# EAGLE schematic RoversGitaarReverb (EAGLE 7.7.0)
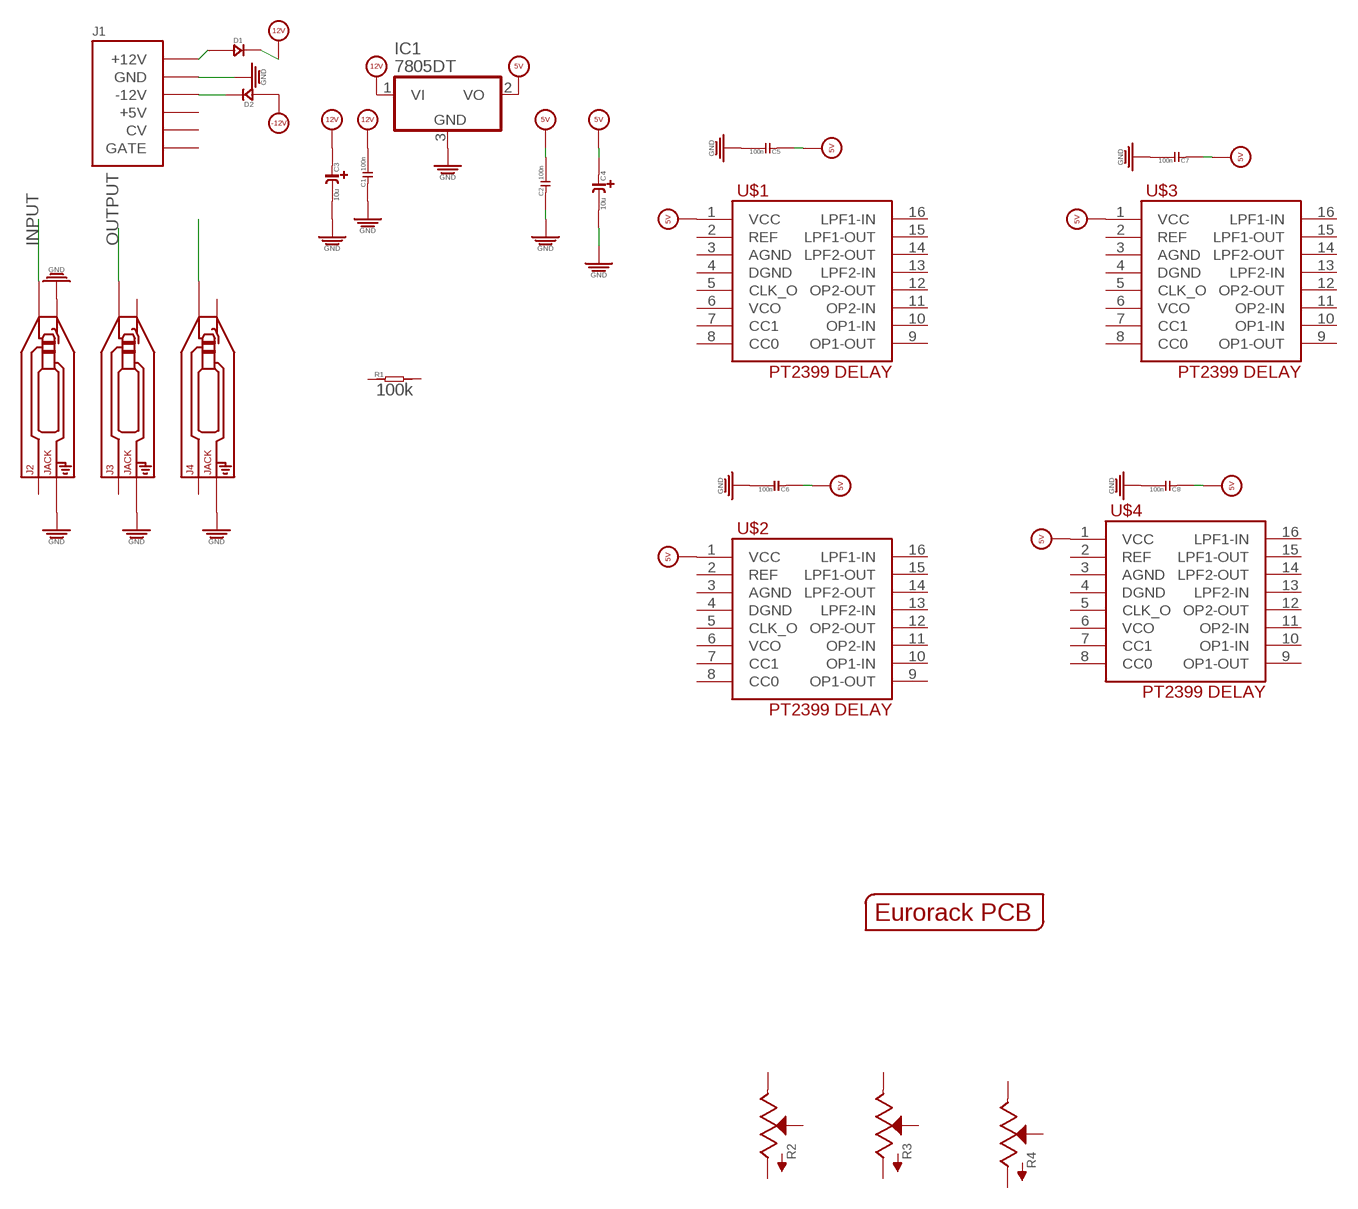
[diagram p0: schematic, sheet 1]

## Parts
C1  100n  C-0603  [C0603]
C2  100n  C-0603  [C0603]
C3  10u  C-POLAR-A  [CASE-A_3216]
C4  10u  C-POLAR-A  [CASE-A_3216]
C5  100n  C-0603  [C0603]
C6  100n  C-0603  [C0603]
C7  100n  C-0603  [C0603]
C8  100n  C-0603  [C0603]
D1  D-SMA  [DO-214AC]
D2  D-SMA  [DO-214AC]
IC1  7805DT  [TO252]
J1  POWERSHROUDED  [POWER_16_SHROUDED]
J2  JACK  AUDIO-JACK_SMALLSYMBOLNODRILL  [3.5MM-JACK-SWITCH-13MM-NOHOLES]
J3  JACK  AUDIO-JACK_SMALLSYMBOLNODRILL  [3.5MM-JACK-SWITCH-13MM-NOHOLES]
J4  JACK  AUDIO-JACK_SMALLSYMBOLNODRILL  [3.5MM-JACK-SWITCH-13MM-NOHOLES]
PCB1  EURORACK_PCB12HP  [EURORACK12HPPCB]
R1  100k  R-0603  [R0603]
R2  POTSQUAREHOLE_SMALLKNOB  [ALPS_POT_SQUAREHOLES]
R3  POTSQUAREHOLE_SMALLKNOB  [ALPS_POT_SQUAREHOLES]
R4  POTSQUAREHOLE_SMALLKNOB  [ALPS_POT_SQUAREHOLES]
U$1  PT2399  [SO16]
U$2  PT2399  [SO16]
U$3  PT2399  [SO16]
U$4  PT2399  [SO16]

## Nets
5V: C2.2 C4.+ C5.1 C6.1 C7.1 C8.1 IC1.2(VO) U$1.1(VCC) U$2.1(VCC) U$3.1(VCC) U$4.1(VCC)
12V: C1.2 C3.+ D1.2(-) IC1.1(VI)
-12V: D2.1(+)
GND: C1.1 C2.1 C3.- C4.- C5.2 C6.2 C7.2 C8.2 IC1.3(GND) J1.3(GND) J1.4(GND) J1.5(GND) J1.6(GND) J1.7(GND) J1.8(GND) J2.RING_B@1(RING) J2.RING_T@3(RING) J2.SWITCH_B@1(SWITCH) J2.SWITCH_T@3(SWITCH) J3.RING_B@1(RING) J3.RING_T@3(RING) J4.RING_B@1(RING) J4.RING_T@3(RING)
INPUT: J2.TIP_B@1(TIP) J2.TIP_T@3(TIP)
N$1: D1.1(+) J1.9(+12V) J1.10(+12V)
N$2: D2.2(-) J1.1(-12V) J1.2(-12V)
N$4: J4.TIP_B@1(TIP) J4.TIP_T@3(TIP)
OUTPUT: J3.TIP_B@1(TIP) J3.TIP_T@3(TIP)
Unconnected: J1.11(+5V) J1.12(+5V) J1.13(CV) J1.14(CV) J1.15(GATE) J1.16(GATE) J2.SECOND_B@1(SECOND) J2.SECOND_T@3(SECOND) J3.SECOND_B@1(SECOND) J3.SECOND_T@3(SECOND) J3.SWITCH_B@1(SWITCH) J3.SWITCH_T@3(SWITCH) J4.SECOND_B@1(SECOND) J4.SECOND_T@3(SECOND) J4.SWITCH_B@1(SWITCH) J4.SWITCH_T@3(SWITCH) R1.1 R1.2 R2.P$1(E) R2.P$2(S) R2.P$3(A) R3.P$1(E) R3.P$2(S) R3.P$3(A) R4.P$1(E) R4.P$2(S) R4.P$3(A) U$1.2(REF) U$1.3(AGND) U$1.4(DGND) U$1.5(CLK_O) U$1.6(VCO) U$1.7(CC1) U$1.8(CC0) U$1.9(OP1-OUT) U$1.10(OP1-IN) U$1.11(OP2-IN) U$1.12(OP2-OUT) U$1.13(LPF2-IN) U$1.14(LPF2-OUT) U$1.15(LPF1-OUT) U$1.16(LPF1-IN) U$2.2(REF) U$2.3(AGND) U$2.4(DGND) U$2.5(CLK_O) U$2.6(VCO) U$2.7(CC1) U$2.8(CC0) U$2.9(OP1-OUT) U$2.10(OP1-IN) U$2.11(OP2-IN) U$2.12(OP2-OUT) U$2.13(LPF2-IN) U$2.14(LPF2-OUT) U$2.15(LPF1-OUT) U$2.16(LPF1-IN) U$3.2(REF) U$3.3(AGND) U$3.4(DGND) U$3.5(CLK_O) U$3.6(VCO) U$3.7(CC1) U$3.8(CC0) U$3.9(OP1-OUT) U$3.10(OP1-IN) U$3.11(OP2-IN) U$3.12(OP2-OUT) U$3.13(LPF2-IN) U$3.14(LPF2-OUT) U$3.15(LPF1-OUT) U$3.16(LPF1-IN) U$4.2(REF) U$4.3(AGND) U$4.4(DGND) U$4.5(CLK_O) U$4.6(VCO) U$4.7(CC1) U$4.8(CC0) U$4.9(OP1-OUT) U$4.10(OP1-IN) U$4.11(OP2-IN) U$4.12(OP2-OUT) U$4.13(LPF2-IN) U$4.14(LPF2-OUT) U$4.15(LPF1-OUT) U$4.16(LPF1-IN)

## Library data of the parts
C1 C2 C5-C8 = OPL:C*
C3 C4 = EurorackModularParts:C-POLAR*
D1 D2 = OPL:D*: DIODE
IC1 = adafruit:78*: Positive VOLTAGE REGULATOR Added bigger pads to the TO-92 package
J1 = EurorackModularParts:POWER
J2 = EurorackModularParts:AUDIO-JACK_SMALLSYMBOL: Switching Mono 3.5mm Audio Jack from Erthenvar.; DESC: Input
J3 = EurorackModularParts:AUDIO-JACK_SMALLSYMBOL: Switching Mono 3.5mm Audio Jack from Erthenvar.; DESC: Output
J4 = EurorackModularParts:AUDIO-JACK_SMALLSYMBOL: Switching Mono 3.5mm Audio Jack from Erthenvar.
PCB1 = EurorackModularParts:EURORACK_PCB
R1 = OPL:R*
R2-R4 = EurorackModularParts:POT
U$1-U$4 = EurorackModularParts:PT2399